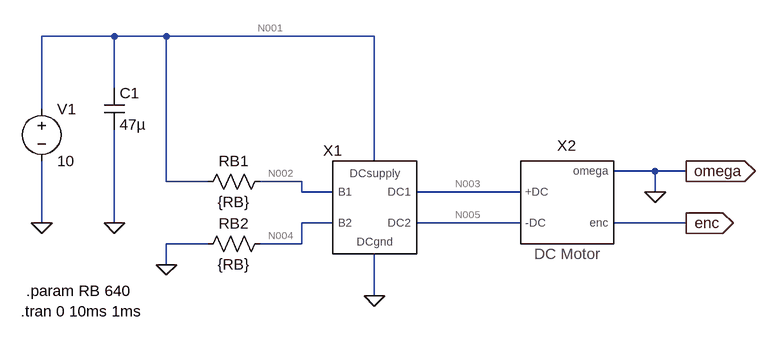
[diagram p0: schematic DC_Motor_Driver_t.asc]
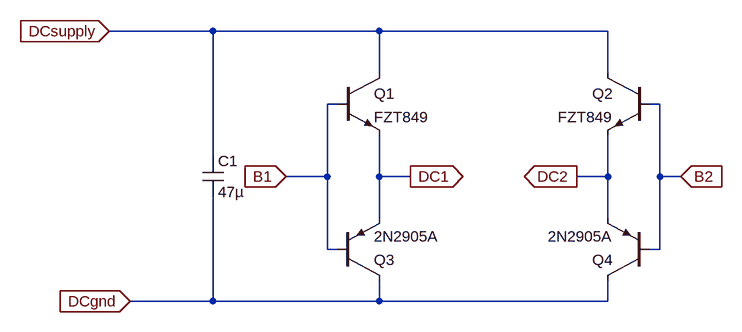
[diagram p1: sub-circuit dc_motor_driver.asc]
DC_Motor_Driver_t.asc, the LTspice schematic file:
Version 4
SHEET 1 880 680
WIRE -160 -128 -272 -128
WIRE -80 -128 -160 -128
WIRE 240 -128 -80 -128
WIRE -160 -48 -160 -128
WIRE -272 -16 -272 -128
WIRE 240 64 240 -128
WIRE 672 80 608 80
WIRE 720 80 672 80
WIRE -80 96 -80 -128
WIRE -16 96 -80 96
WIRE 128 96 64 96
WIRE 128 112 128 96
WIRE 176 112 128 112
WIRE 464 112 304 112
WIRE 672 112 672 80
WIRE -272 160 -272 64
WIRE -160 160 -160 16
WIRE 176 160 128 160
WIRE 464 160 304 160
WIRE 720 160 608 160
WIRE -16 192 -80 192
WIRE 128 192 128 160
WIRE 128 192 64 192
WIRE -80 224 -80 192
WIRE 240 272 240 208
FLAG -272 160 0
FLAG -160 160 0
FLAG -80 224 0
FLAG 240 272 0
FLAG 720 160 enc
IOPIN 720 160 Out
FLAG 720 80 omega
IOPIN 720 80 Out
FLAG 672 112 0
SYMBOL res 80 80 R90
WINDOW 0 0 56 VBottom 2
WINDOW 3 32 56 VTop 2
SYMATTR InstName RB1
SYMATTR Value {RB}
SYMBOL res 80 176 R90
WINDOW 0 0 56 VBottom 2
WINDOW 3 32 56 VTop 2
SYMATTR InstName RB2
SYMATTR Value {RB}
SYMBOL voltage -272 -32 R0
WINDOW 123 0 0 Left 2
WINDOW 39 0 0 Left 2
SYMATTR InstName V1
SYMATTR Value 10
SYMBOL cap -176 -48 R0
SYMATTR InstName C1
SYMATTR Value 47µ
SYMBOL DC_Motor_Driver 240 128 R0
SYMATTR InstName X1
SYMBOL DC_motor_model 528 128 R0
SYMATTR InstName X2
TEXT -304 296 Left 2 !.tran 0 10ms 1ms
TEXT -296 264 Left 2 !.param RB 640

dc_motor_driver.asc, the sub-circuit schematic file:
Version 4
SHEET 1 972 680
WIRE 160 0 0 0
WIRE 416 0 160 0
WIRE 768 0 416 0
WIRE 416 64 416 0
WIRE 768 64 768 0
WIRE 352 112 336 112
WIRE 848 112 832 112
WIRE 160 192 160 0
WIRE 336 224 336 112
WIRE 336 224 272 224
WIRE 416 224 416 160
WIRE 464 224 416 224
WIRE 768 224 768 160
WIRE 768 224 720 224
WIRE 848 224 848 112
WIRE 880 224 848 224
WIRE 416 288 416 224
WIRE 768 288 768 224
WIRE 336 336 336 224
WIRE 352 336 336 336
WIRE 848 336 848 224
WIRE 848 336 832 336
WIRE 160 416 160 256
WIRE 160 416 32 416
WIRE 416 416 416 384
WIRE 416 416 160 416
WIRE 768 416 768 384
WIRE 768 416 416 416
FLAG 0 0 DCsupply
IOPIN 0 0 In
FLAG 32 416 DCgnd
IOPIN 32 416 In
FLAG 272 224 B1
IOPIN 272 224 In
FLAG 464 224 DC1
IOPIN 464 224 Out
FLAG 720 224 DC2
IOPIN 720 224 Out
FLAG 880 224 B2
IOPIN 880 224 In
SYMBOL pnp 832 384 R180
SYMATTR InstName Q4
SYMATTR Value 2N2905A
SYMBOL pnp 352 384 M180
SYMATTR InstName Q3
SYMATTR Value 2N2905A
SYMBOL npn 352 64 R0
SYMATTR InstName Q1
SYMATTR Value FZT849
SYMBOL npn 832 64 M0
SYMATTR InstName Q2
SYMATTR Value FZT849
SYMBOL cap 144 192 R0
SYMATTR InstName C1
SYMATTR Value 47µ

The netlist it stands for:
* DC_Motor_Driver_t.asc
RB1 N002 N001 {RB}
RB2 N004 0 {RB}
V1 N001 0 10
C1 N001 0 47µ
XX1 N002 N004 N003 N005 N001 0 dc_motor_driver
XX2 N003 N005 enc 0 DC_motor_model  ; pins +DC -DC enc omega

* block symbol definitions
.subckt dc_motor_driver B1 B2 DC1 DC2 DCsupply DCgnd
Q4 DCgnd B2 DC2 0 2N2905A
Q3 DCgnd B1 DC1 0 2N2905A
Q1 DCsupply B1 DC1 0 FZT849
Q2 DCsupply B2 DC2 0 FZT849
C1 DCsupply DCgnd 47µ
.ends dc_motor_driver

.model NPN NPN
.model PNP PNP
.lib standard.bjt
.tran 0 10ms 1ms
.param RB 640
.backanno
.end

* Results of the author's LTspice run, read from the files saved beside the schematic
* Operating Point, zero values left out:
*   V(n002) = 7.421 V
*   V(n001) = 10 V
*   V(n004) = 4.072 V
*   V(n005) = 5.05 V
*   V(n003) = 6.682 V
*   V(enc) = 5 V
*   I(Rb2) = 6.363 mA
*   I(Rb1) = -4.029 mA
*   I(V1) = -862.7 mA
*   Ix(x1:B1) = 4.029 mA
*   Ix(x1:B2) = -6.363 mA
*   Ix(x1:DC1) = -862.7 mA
*   Ix(x1:DC2) = 862.7 mA
*   Ix(x1:DCSUPPLY) = 858.7 mA
*   Ix(x1:DCGND) = -856.4 mA
*   Ix(x2:+DC) = 862.7 mA
*   Ix(x2:-DC) = -862.7 mA
*   Ix(x2:OMEGA) = -799.8 mA